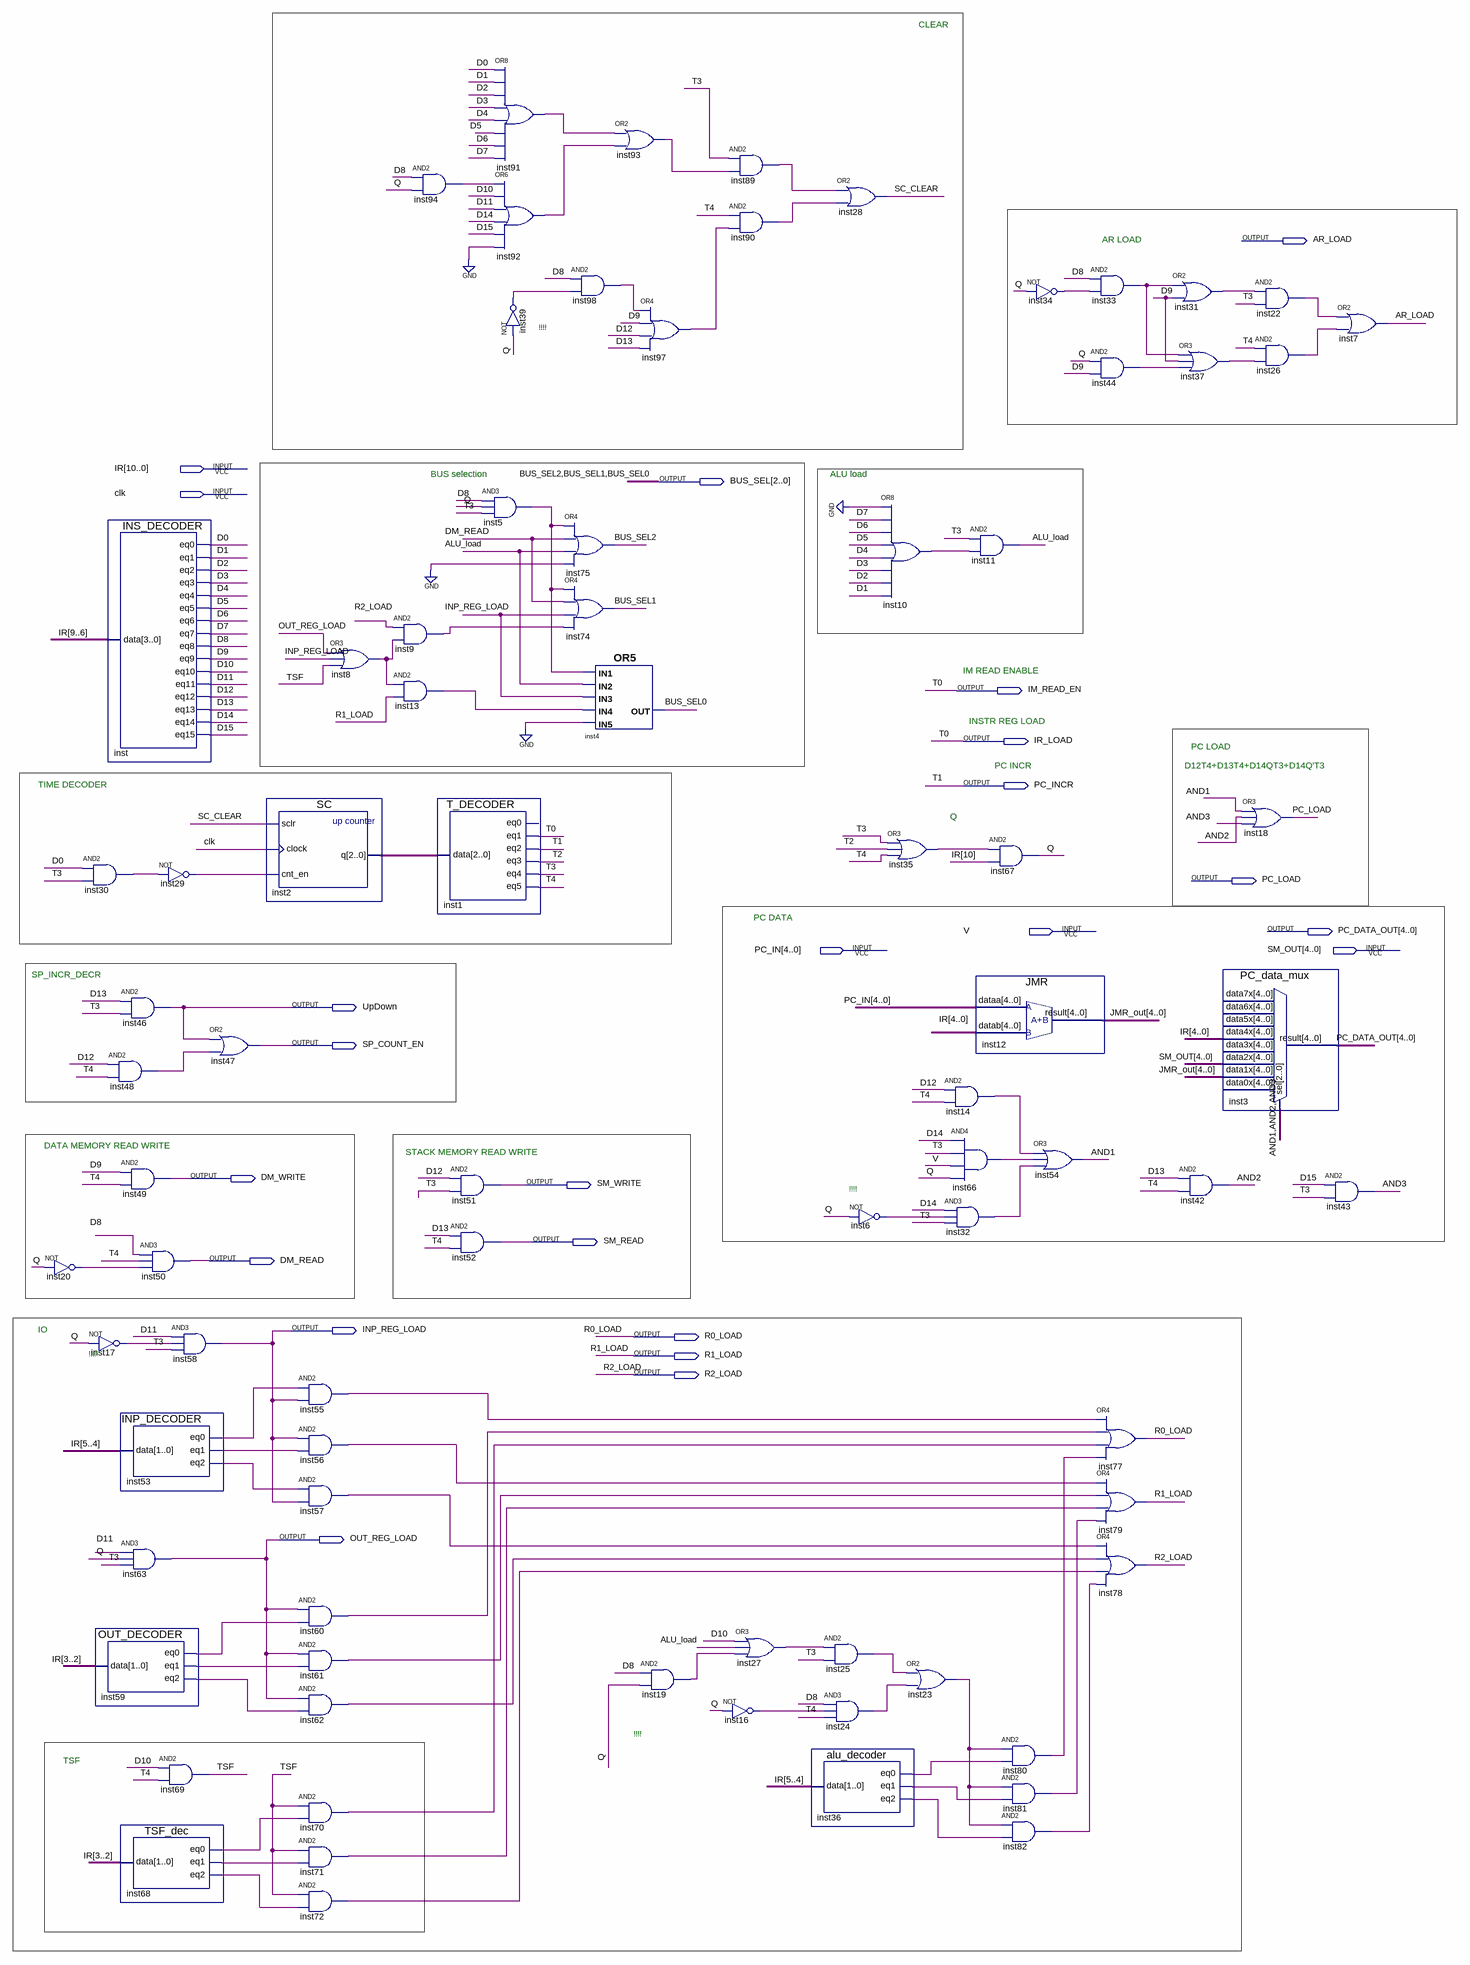
[diagram p0: schematic sheet]
// Quartus schematic CU_GROUP34.bdf as structural Verilog: 81 symbols, 23 pins
module CU_GROUP34 (
  input  [10:0] IR,
  input  clk,
  input  V,
  input  [4:0] PC_IN,
  input  [4:0] SM_OUT,
  output AR_LOAD,
  output [2:0] BUS_SEL,
  output IM_READ_EN,
  output IR_LOAD,
  output PC_INCR,
  output PC_LOAD,
  output [4:0] PC_DATA_OUT,
  output UpDown,
  output SP_COUNT_EN,
  output DM_WRITE,
  output SM_WRITE,
  output SM_READ,
  output DM_READ,
  output INP_REG_LOAD,
  output R0_LOAD,
  output R1_LOAD,
  output R2_LOAD,
  output OUT_REG_LOAD
);

  wire ALU_load, AND1, AND2, AND3, D0, D1, D2, D3, D4, D5, D6, D7, D8, D9, D10, D11, D12, D13, D14, D15,
       inst5_out, inst6_out, inst8_out, inst9_out, inst10_out, inst13_out, inst14_out, inst16_out,
       inst17_out, inst19_out, inst20_out, inst22_out, inst23_out, inst24_out, inst25_out, inst26_out,
       inst27_out, inst29_out, inst30_out, inst31_out, inst32_out, inst33_out, inst34_out, inst35_out,
       inst36_eq0, inst36_eq1, inst36_eq2, inst37_out, inst39_out, inst44_out, inst48_out, inst53_eq0,
       inst53_eq1, inst53_eq2, inst55_out, inst56_out, inst57_out, inst59_eq0, inst59_eq1, inst59_eq2,
       inst60_out, inst61_out, inst62_out, inst66_out, inst68_eq0, inst68_eq1, inst68_eq2, inst70_out,
       inst71_out, inst72_out, inst80_out, inst81_out, inst82_out, inst89_out, inst90_out, inst91_out,
       inst92_out, inst93_out, inst94_out, inst97_out, inst98_out, Q, SC_CLEAR, T2, T3, T4, TSF;
  wire [2:0] inst2_q;
  wire [4:0] JMR_out;

  not inst20 (inst20_out, Q);
  INS_DECODER inst (
    .data(IR[9:6]), .eq0(D0), .eq1(D1), .eq2(D2), .eq3(D3), .eq4(D4), .eq5(D5), .eq6(D6), .eq7(D7), .eq8(D8),
    .eq9(D9), .eq10(D10), .eq11(D11), .eq12(D12), .eq13(D13), .eq14(D14), .eq15(D15));
  and inst30 (inst30_out, D0, T3);
  and inst48 (inst48_out, D12, T4);
  not inst17 (inst17_out, Q);
  OUT_DECODER inst59 (.data(IR[3:2]), .eq0(inst59_eq0), .eq1(inst59_eq1), .eq2(inst59_eq2));
  not inst29 (inst29_out, inst30_out);
  and inst46 (UpDown, D13, T3);
  and inst49 (DM_WRITE, D9, T4);
  and inst50 (DM_READ, D8, T4, inst20_out);
  INP_DECODER inst53 (.data(IR[5:4]), .eq0(inst53_eq0), .eq1(inst53_eq1), .eq2(inst53_eq2));
  and inst63 (OUT_REG_LOAD, D11, Q, T3);
  and inst69 (TSF, D10, T4);
  TSF_dec inst68 (.data(IR[3:2]), .eq0(inst68_eq0), .eq1(inst68_eq1), .eq2(inst68_eq2));
  or inst47 (SP_COUNT_EN, UpDown, inst48_out);
  and inst58 (INP_REG_LOAD, D11, inst17_out, T3);
  SC inst2 (.sclr(SC_CLEAR), .clock(clk), .cnt_en(inst29_out), .q(inst2_q));
  and inst55 (inst55_out, inst53_eq0, INP_REG_LOAD);
  and inst56 (inst56_out, INP_REG_LOAD, inst53_eq1);
  and inst57 (inst57_out, inst53_eq2, INP_REG_LOAD);
  and inst60 (inst60_out, OUT_REG_LOAD, inst59_eq0);
  and inst61 (inst61_out, OUT_REG_LOAD, inst59_eq1);
  and inst62 (inst62_out, OUT_REG_LOAD, inst59_eq2);
  and inst70 (inst70_out, TSF, inst68_eq0);
  and inst71 (inst71_out, TSF, inst68_eq1);
  and inst72 (inst72_out, TSF, inst68_eq2);
  or inst8 (inst8_out, OUT_REG_LOAD, INP_REG_LOAD, TSF);
  and inst94 (inst94_out, D8, Q);
  and inst9 (inst9_out, R2_LOAD, inst8_out);
  and inst13 (inst13_out, inst8_out, R1_LOAD);
  T_DECODER inst1 (.data(inst2_q), .eq1(IM_READ_EN), .eq2(PC_INCR), .eq3(T2), .eq4(T3), .eq5(T4));  // open: eq0
  and inst51 (SM_WRITE, D12, T3);
  and inst52 (SM_READ, D13, T4);
  or inst91 (inst91_out, D0, D1, D2, D3, D4, D5, D6, D7);
  or inst92 (inst92_out, inst94_out, D10, D11, D14, D15, 1'b0);
  not inst39 (inst39_out, Q);
  and inst5 (inst5_out, D8, Q, T3);
  and inst98 (inst98_out, D8, inst39_out);
  or inst75 (BUS_SEL[2], inst5_out, DM_READ, ALU_load, 1'b0);
  or inst74 (BUS_SEL[1], inst5_out, DM_READ, INP_REG_LOAD, inst9_out);
  or inst93 (inst93_out, inst91_out, inst92_out);
  or inst4 (BUS_SEL[0], inst5_out, ALU_load, INP_REG_LOAD, inst13_out, 1'b0);
  or inst97 (inst97_out, inst98_out, D9, D12, D13);
  and inst19 (inst19_out, D8, Q);
  not inst16 (inst16_out, Q);
  and inst89 (inst89_out, T3, inst93_out);
  and inst90 (inst90_out, T4, inst97_out);
  or inst27 (inst27_out, D10, ALU_load, inst19_out);
  and inst25 (inst25_out, inst27_out, T3);
  and inst24 (inst24_out, D8, inst16_out, T4);
  alu_decoder inst36 (.data(IR[5:4]), .eq0(inst36_eq0), .eq1(inst36_eq1), .eq2(inst36_eq2));
  or inst28 (SC_CLEAR, inst89_out, inst90_out);
  not inst6 (inst6_out, Q);
  or inst10 (inst10_out, 1'b0, D7, D6, D5, D4, D3, D2, D1);
  or inst35 (inst35_out, T3, T2, T4);
  or inst23 (inst23_out, inst25_out, inst24_out);
  and inst11 (ALU_load, T3, inst10_out);
  JMR inst12 (.dataa(PC_IN), .datab(IR[4:0]), .result(JMR_out));
  and inst14 (inst14_out, D12, T4);
  and inst66 (inst66_out, D14, T3, V, Q);
  and inst32 (inst32_out, D14, inst6_out, T3);
  not inst34 (inst34_out, Q);
  and inst67 (Q, inst35_out, IR[10]);
  and inst80 (inst80_out, inst23_out, inst36_eq0);
  and inst81 (inst81_out, inst23_out, inst36_eq1);
  and inst82 (inst82_out, inst23_out, inst36_eq2);
  or inst54 (AND1, inst14_out, inst66_out, inst32_out);
  and inst33 (inst33_out, D8, inst34_out);
  and inst44 (inst44_out, Q, D9);
  or inst77 (R0_LOAD, inst55_out, inst60_out, inst70_out, inst80_out);
  or inst79 (R1_LOAD, inst56_out, inst61_out, inst71_out, inst81_out);
  or inst78 (R2_LOAD, inst57_out, inst62_out, inst72_out, inst82_out);
  or inst31 (inst31_out, inst33_out, D9);
  or inst37 (inst37_out, inst33_out, D9, inst44_out);
  and inst42 (AND2, D13, T4);
  PC_data_mux inst3 (
    .data4x(IR[4:0]), .data2x(SM_OUT), .data1x(JMR_out), .sel({AND1, AND2, AND3}), .result(PC_DATA_OUT));  // open: data7x, data6x, data5x, data3x, data0x
  and inst22 (inst22_out, inst31_out, T3);
  and inst26 (inst26_out, T4, inst37_out);
  or inst18 (PC_LOAD, AND1, AND2, AND3);
  and inst43 (AND3, D15, T3);
  or inst7 (AR_LOAD, inst22_out, inst26_out);

  assign IR_LOAD = IM_READ_EN;

  // Other names for the same wires on the sheet: T0 = IM_READ_EN; T1 = PC_INCR

  // Notes on the sheet:
  //   CLEAR
  //   AR LOAD
  //   !!!!
  //   BUS selection
  //   ALU load
  //   IM READ ENABLE
  //   INSTR REG LOAD
  //   PC LOAD
  //   PC INCR
  //   D12T4+D13T4+D14QT3+D14Q'T3
  //   TIME DECODER
  //   Q
  //   PC DATA
  //   SP_INCR_DECR   
  //   DATA MEMORY READ WRITE
  //   STACK MEMORY READ WRITE
  //   !!!!
  //   IO
  //   !!!!
  //   !!!!
  //   TSF
endmodule
